# Altium schematic sheet Keymatrix_switches.SchDoc: Keymatrix switches
size 594 x 420 mm; SheetNumber: 2; SheetTotal: 4; DocSize: DINA2
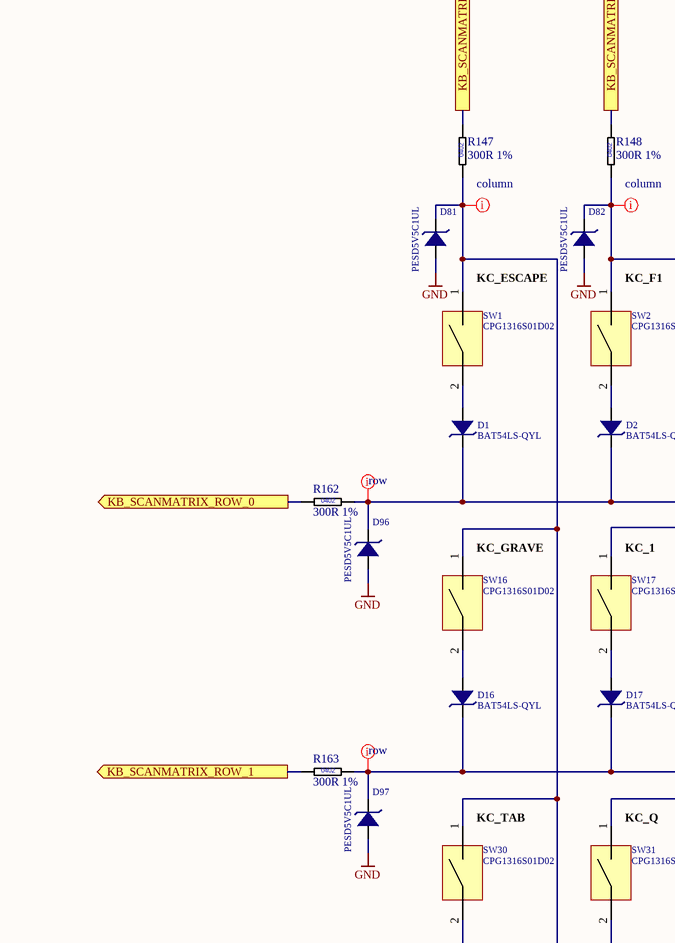
[diagram p0: Keymatrix_switches.SchDoc, top middle]
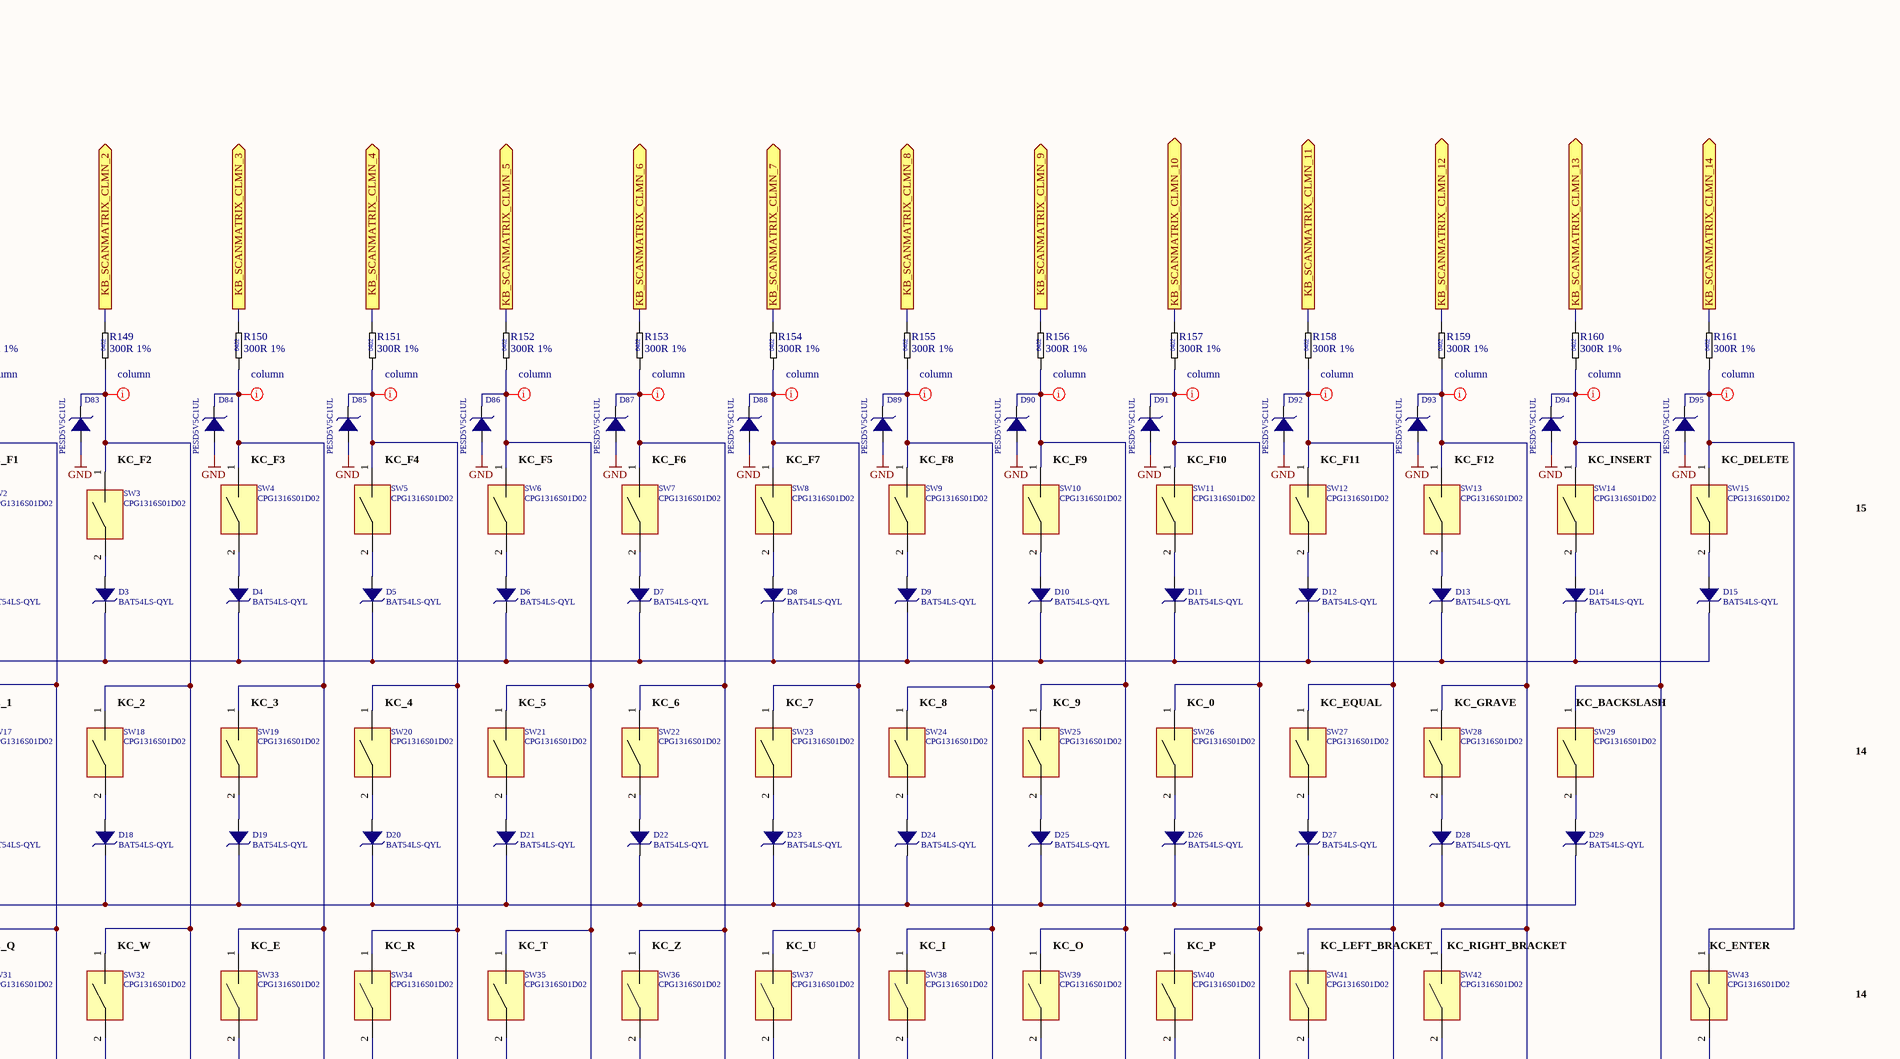
[diagram p1: Keymatrix_switches.SchDoc, top right]
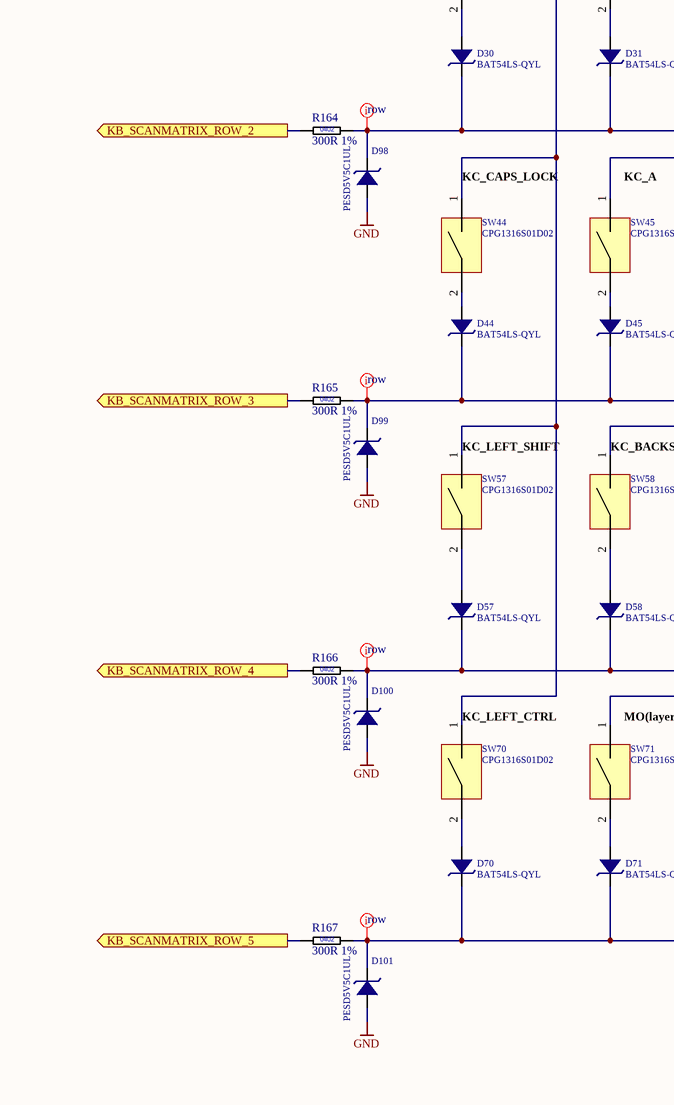
[diagram p2: Keymatrix_switches.SchDoc, bottom middle]
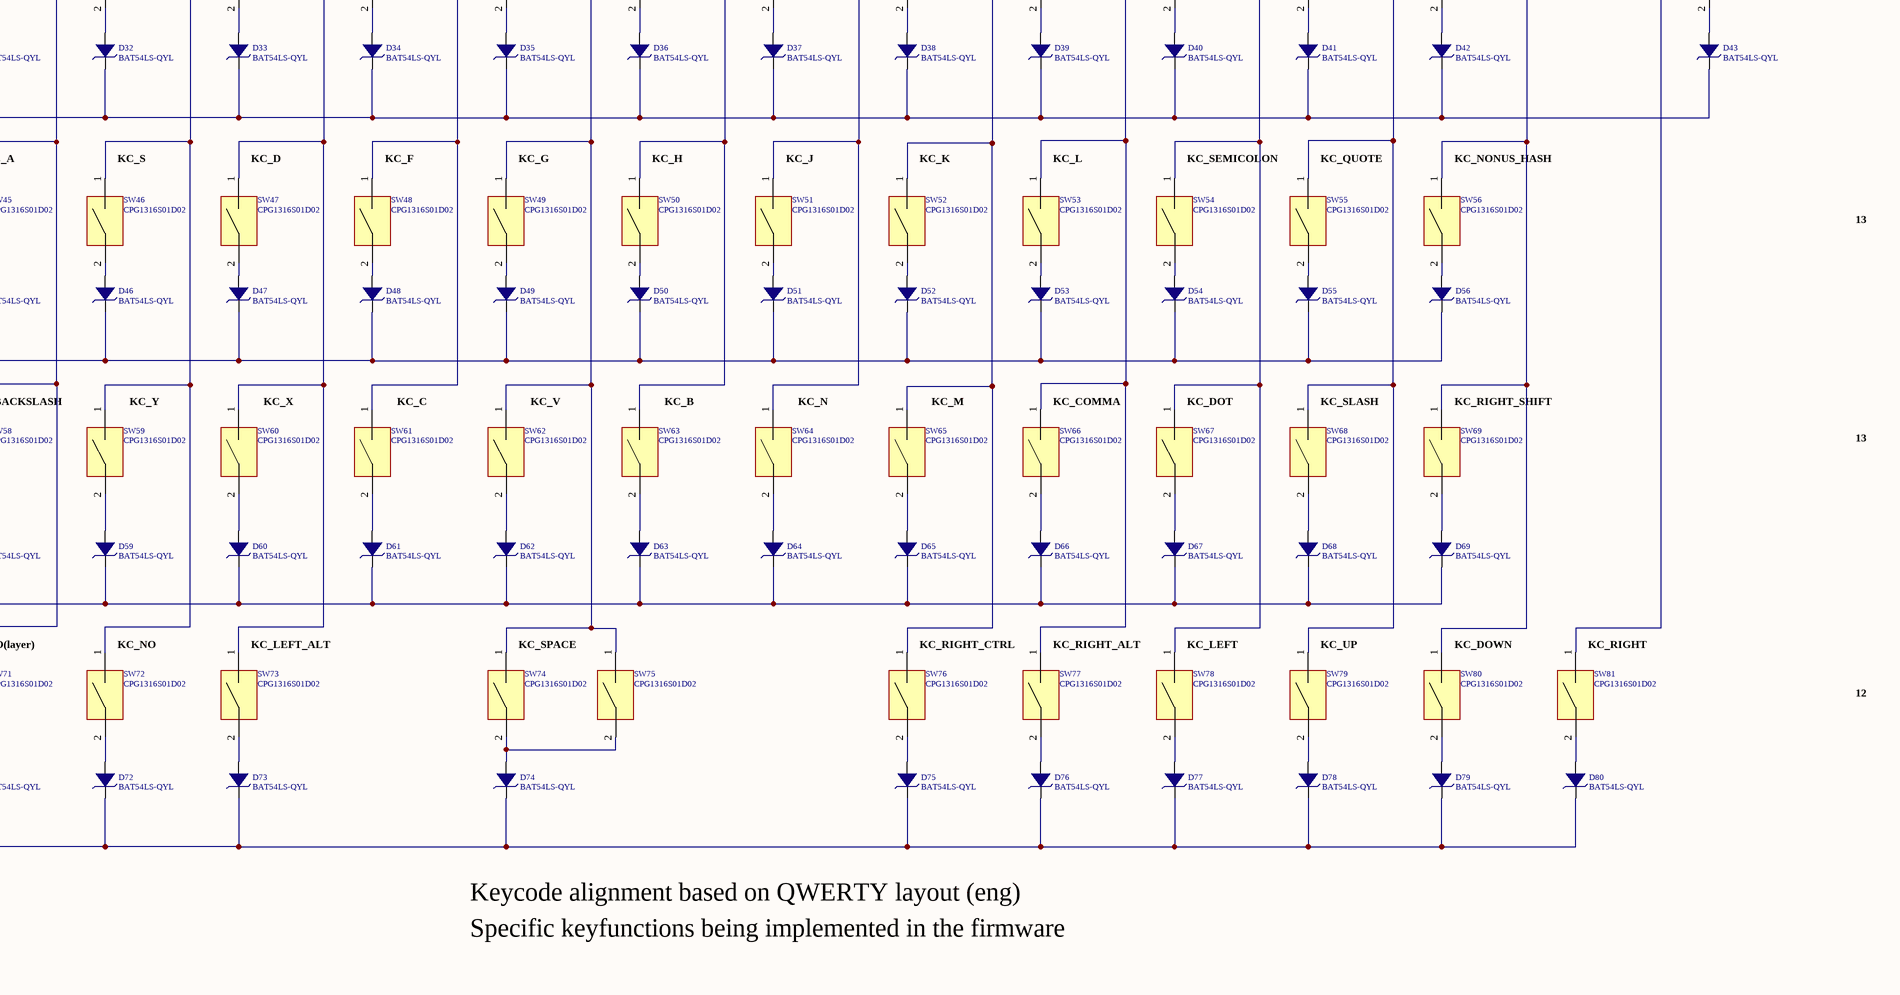
[diagram p3: Keymatrix_switches.SchDoc, bottom right]

## Parts
?  (no value)  (graphical)
D1  BAT54LS-QYL  [DFN1006-2A]
D2  BAT54LS-QYL  [DFN1006-2A]
D3  BAT54LS-QYL  [DFN1006-2A]
D4  BAT54LS-QYL  [DFN1006-2A]
D5  BAT54LS-QYL  [DFN1006-2A]
D6  BAT54LS-QYL  [DFN1006-2A]
D7  BAT54LS-QYL  [DFN1006-2A]
D8  BAT54LS-QYL  [DFN1006-2A]
D9  BAT54LS-QYL  [DFN1006-2A]
D10  BAT54LS-QYL  [DFN1006-2A]
D11  BAT54LS-QYL  [DFN1006-2A]
D12  BAT54LS-QYL  [DFN1006-2A]
D13  BAT54LS-QYL  [DFN1006-2A]
D14  BAT54LS-QYL  [DFN1006-2A]
D15  BAT54LS-QYL  [DFN1006-2A]
D16  BAT54LS-QYL  [DFN1006-2A]
D17  BAT54LS-QYL  [DFN1006-2A]
D18  BAT54LS-QYL  [DFN1006-2A]
D19  BAT54LS-QYL  [DFN1006-2A]
D20  BAT54LS-QYL  [DFN1006-2A]
D21  BAT54LS-QYL  [DFN1006-2A]
D22  BAT54LS-QYL  [DFN1006-2A]
D23  BAT54LS-QYL  [DFN1006-2A]
D24  BAT54LS-QYL  [DFN1006-2A]
D25  BAT54LS-QYL  [DFN1006-2A]
D26  BAT54LS-QYL  [DFN1006-2A]
D27  BAT54LS-QYL  [DFN1006-2A]
D28  BAT54LS-QYL  [DFN1006-2A]
D29  BAT54LS-QYL  [DFN1006-2A]
D30  BAT54LS-QYL  [DFN1006-2A]
D31  BAT54LS-QYL  [DFN1006-2A]
D32  BAT54LS-QYL  [DFN1006-2A]
D33  BAT54LS-QYL  [DFN1006-2A]
D34  BAT54LS-QYL  [DFN1006-2A]
D35  BAT54LS-QYL  [DFN1006-2A]
D36  BAT54LS-QYL  [DFN1006-2A]
D37  BAT54LS-QYL  [DFN1006-2A]
D38  BAT54LS-QYL  [DFN1006-2A]
D39  BAT54LS-QYL  [DFN1006-2A]
D40  BAT54LS-QYL  [DFN1006-2A]
D41  BAT54LS-QYL  [DFN1006-2A]
D42  BAT54LS-QYL  [DFN1006-2A]
D43  BAT54LS-QYL  [DFN1006-2A]
D44  BAT54LS-QYL  [DFN1006-2A]
D45  BAT54LS-QYL  [DFN1006-2A]
D46  BAT54LS-QYL  [DFN1006-2A]
D47  BAT54LS-QYL  [DFN1006-2A]
D48  BAT54LS-QYL  [DFN1006-2A]
D49  BAT54LS-QYL  [DFN1006-2A]
D50  BAT54LS-QYL  [DFN1006-2A]
D51  BAT54LS-QYL  [DFN1006-2A]
D52  BAT54LS-QYL  [DFN1006-2A]
D53  BAT54LS-QYL  [DFN1006-2A]
D54  BAT54LS-QYL  [DFN1006-2A]
D55  BAT54LS-QYL  [DFN1006-2A]
D56  BAT54LS-QYL  [DFN1006-2A]
D57  BAT54LS-QYL  [DFN1006-2A]
D58  BAT54LS-QYL  [DFN1006-2A]
D59  BAT54LS-QYL  [DFN1006-2A]
D60  BAT54LS-QYL  [DFN1006-2A]
D61  BAT54LS-QYL  [DFN1006-2A]
D62  BAT54LS-QYL  [DFN1006-2A]
D63  BAT54LS-QYL  [DFN1006-2A]
D64  BAT54LS-QYL  [DFN1006-2A]
D65  BAT54LS-QYL  [DFN1006-2A]
D66  BAT54LS-QYL  [DFN1006-2A]
D67  BAT54LS-QYL  [DFN1006-2A]
D68  BAT54LS-QYL  [DFN1006-2A]
D69  BAT54LS-QYL  [DFN1006-2A]
D70  BAT54LS-QYL  [DFN1006-2A]
D71  BAT54LS-QYL  [DFN1006-2A]
D72  BAT54LS-QYL  [DFN1006-2A]
D73  BAT54LS-QYL  [DFN1006-2A]
D74  BAT54LS-QYL  [DFN1006-2A]
D75  BAT54LS-QYL  [DFN1006-2A]
D76  BAT54LS-QYL  [DFN1006-2A]
D77  BAT54LS-QYL  [DFN1006-2A]
D78  BAT54LS-QYL  [DFN1006-2A]
D79  BAT54LS-QYL  [DFN1006-2A]
D80  BAT54LS-QYL  [DFN1006-2A]
D81  PESD5V5C1UL  [DFN65P100X50-2N]
D82  PESD5V5C1UL  [DFN65P100X50-2N]
D83  PESD5V5C1UL  [DFN65P100X50-2N]
D84  PESD5V5C1UL  [DFN65P100X50-2N]
D85  PESD5V5C1UL  [DFN65P100X50-2N]
D86  PESD5V5C1UL  [DFN65P100X50-2N]
D87  PESD5V5C1UL  [DFN65P100X50-2N]
D88  PESD5V5C1UL  [DFN65P100X50-2N]
D89  PESD5V5C1UL  [DFN65P100X50-2N]
D90  PESD5V5C1UL  [DFN65P100X50-2N]
D91  PESD5V5C1UL  [DFN65P100X50-2N]
D92  PESD5V5C1UL  [DFN65P100X50-2N]
D93  PESD5V5C1UL  [DFN65P100X50-2N]
D94  PESD5V5C1UL  [DFN65P100X50-2N]
D95  PESD5V5C1UL  [DFN65P100X50-2N]
D96  PESD5V5C1UL  [DFN65P100X50-2N]
D97  PESD5V5C1UL  [DFN65P100X50-2N]
D98  PESD5V5C1UL  [DFN65P100X50-2N]
D99  PESD5V5C1UL  [DFN65P100X50-2N]
D100  PESD5V5C1UL  [DFN65P100X50-2N]
D101  PESD5V5C1UL  [DFN65P100X50-2N]
R147  300R 1%  [RESC1005X04L]
R148  300R 1%  [RESC1005X04L]
R149  300R 1%  [RESC1005X04L]
R150  300R 1%  [RESC1005X04L]
R151  300R 1%  [RESC1005X04L]
R152  300R 1%  [RESC1005X04L]
R153  300R 1%  [RESC1005X04L]
R154  300R 1%  [RESC1005X04L]
R155  300R 1%  [RESC1005X04L]
R156  300R 1%  [RESC1005X04L]
R157  300R 1%  [RESC1005X04L]
R158  300R 1%  [RESC1005X04L]
R159  300R 1%  [RESC1005X04L]
R160  300R 1%  [RESC1005X04L]
R161  300R 1%  [RESC1005X04L]
R162  300R 1%  [RESC1005X04L]
R163  300R 1%  [RESC1005X04L]
R164  300R 1%  [RESC1005X04L]
R165  300R 1%  [RESC1005X04L]
R166  300R 1%  [RESC1005X04L]
R167  300R 1%  [RESC1005X04L]
SW1  CPG1316S01D02  [SW_KEYBOARD_KAIHL-PG1316S]
SW2  CPG1316S01D02  [SW_KEYBOARD_KAIHL-PG1316S]
SW3  CPG1316S01D02  [SW_KEYBOARD_KAIHL-PG1316S]
SW4  CPG1316S01D02  [SW_KEYBOARD_KAIHL-PG1316S]
SW5  CPG1316S01D02  [SW_KEYBOARD_KAIHL-PG1316S]
SW6  CPG1316S01D02  [SW_KEYBOARD_KAIHL-PG1316S]
SW7  CPG1316S01D02  [SW_KEYBOARD_KAIHL-PG1316S]
SW8  CPG1316S01D02  [SW_KEYBOARD_KAIHL-PG1316S]
SW9  CPG1316S01D02  [SW_KEYBOARD_KAIHL-PG1316S]
SW10  CPG1316S01D02  [SW_KEYBOARD_KAIHL-PG1316S]
SW11  CPG1316S01D02  [SW_KEYBOARD_KAIHL-PG1316S]
SW12  CPG1316S01D02  [SW_KEYBOARD_KAIHL-PG1316S]
SW13  CPG1316S01D02  [SW_KEYBOARD_KAIHL-PG1316S]
SW14  CPG1316S01D02  [SW_KEYBOARD_KAIHL-PG1316S]
SW15  CPG1316S01D02  [SW_KEYBOARD_KAIHL-PG1316S]
SW16  CPG1316S01D02  [SW_KEYBOARD_KAIHL-PG1316S]
SW17  CPG1316S01D02  [SW_KEYBOARD_KAIHL-PG1316S]
SW18  CPG1316S01D02  [SW_KEYBOARD_KAIHL-PG1316S]
SW19  CPG1316S01D02  [SW_KEYBOARD_KAIHL-PG1316S]
SW20  CPG1316S01D02  [SW_KEYBOARD_KAIHL-PG1316S]
SW21  CPG1316S01D02  [SW_KEYBOARD_KAIHL-PG1316S]
SW22  CPG1316S01D02  [SW_KEYBOARD_KAIHL-PG1316S]
SW23  CPG1316S01D02  [SW_KEYBOARD_KAIHL-PG1316S]
SW24  CPG1316S01D02  [SW_KEYBOARD_KAIHL-PG1316S]
SW25  CPG1316S01D02  [SW_KEYBOARD_KAIHL-PG1316S]
SW26  CPG1316S01D02  [SW_KEYBOARD_KAIHL-PG1316S]
SW27  CPG1316S01D02  [SW_KEYBOARD_KAIHL-PG1316S]
SW28  CPG1316S01D02  [SW_KEYBOARD_KAIHL-PG1316S]
SW29  CPG1316S01D02  [SW_KEYBOARD_KAIHL-PG1316S]
SW30  CPG1316S01D02  [SW_KEYBOARD_KAIHL-PG1316S]
SW31  CPG1316S01D02  [SW_KEYBOARD_KAIHL-PG1316S]
SW32  CPG1316S01D02  [SW_KEYBOARD_KAIHL-PG1316S]
SW33  CPG1316S01D02  [SW_KEYBOARD_KAIHL-PG1316S]
SW34  CPG1316S01D02  [SW_KEYBOARD_KAIHL-PG1316S]
SW35  CPG1316S01D02  [SW_KEYBOARD_KAIHL-PG1316S]
SW36  CPG1316S01D02  [SW_KEYBOARD_KAIHL-PG1316S]
SW37  CPG1316S01D02  [SW_KEYBOARD_KAIHL-PG1316S]
SW38  CPG1316S01D02  [SW_KEYBOARD_KAIHL-PG1316S]
SW39  CPG1316S01D02  [SW_KEYBOARD_KAIHL-PG1316S]
SW40  CPG1316S01D02  [SW_KEYBOARD_KAIHL-PG1316S]
SW41  CPG1316S01D02  [SW_KEYBOARD_KAIHL-PG1316S]
SW42  CPG1316S01D02  [SW_KEYBOARD_KAIHL-PG1316S]
SW43  CPG1316S01D02  [SW_KEYBOARD_KAIHL-PG1316S]
SW44  CPG1316S01D02  [SW_KEYBOARD_KAIHL-PG1316S]
SW45  CPG1316S01D02  [SW_KEYBOARD_KAIHL-PG1316S]
SW46  CPG1316S01D02  [SW_KEYBOARD_KAIHL-PG1316S]
SW47  CPG1316S01D02  [SW_KEYBOARD_KAIHL-PG1316S]
SW48  CPG1316S01D02  [SW_KEYBOARD_KAIHL-PG1316S]
SW49  CPG1316S01D02  [SW_KEYBOARD_KAIHL-PG1316S]
SW50  CPG1316S01D02  [SW_KEYBOARD_KAIHL-PG1316S]
SW51  CPG1316S01D02  [SW_KEYBOARD_KAIHL-PG1316S]
SW52  CPG1316S01D02  [SW_KEYBOARD_KAIHL-PG1316S]
SW53  CPG1316S01D02  [SW_KEYBOARD_KAIHL-PG1316S]
SW54  CPG1316S01D02  [SW_KEYBOARD_KAIHL-PG1316S]
SW55  CPG1316S01D02  [SW_KEYBOARD_KAIHL-PG1316S]
SW56  CPG1316S01D02  [SW_KEYBOARD_KAIHL-PG1316S]
SW57  CPG1316S01D02  [SW_KEYBOARD_KAIHL-PG1316S]
SW58  CPG1316S01D02  [SW_KEYBOARD_KAIHL-PG1316S]
SW59  CPG1316S01D02  [SW_KEYBOARD_KAIHL-PG1316S]
SW60  CPG1316S01D02  [SW_KEYBOARD_KAIHL-PG1316S]
SW61  CPG1316S01D02  [SW_KEYBOARD_KAIHL-PG1316S]
SW62  CPG1316S01D02  [SW_KEYBOARD_KAIHL-PG1316S]
SW63  CPG1316S01D02  [SW_KEYBOARD_KAIHL-PG1316S]
SW64  CPG1316S01D02  [SW_KEYBOARD_KAIHL-PG1316S]
SW65  CPG1316S01D02  [SW_KEYBOARD_KAIHL-PG1316S]
SW66  CPG1316S01D02  [SW_KEYBOARD_KAIHL-PG1316S]
SW67  CPG1316S01D02  [SW_KEYBOARD_KAIHL-PG1316S]
SW68  CPG1316S01D02  [SW_KEYBOARD_KAIHL-PG1316S]
SW69  CPG1316S01D02  [SW_KEYBOARD_KAIHL-PG1316S]
SW70  CPG1316S01D02  [SW_KEYBOARD_KAIHL-PG1316S]
SW71  CPG1316S01D02  [SW_KEYBOARD_KAIHL-PG1316S]
SW72  CPG1316S01D02  [SW_KEYBOARD_KAIHL-PG1316S]
SW73  CPG1316S01D02  [SW_KEYBOARD_KAIHL-PG1316S]
SW74  CPG1316S01D02  [SW_KEYBOARD_KAIHL-PG1316S]
SW75  CPG1316S01D02  [SW_KEYBOARD_KAIHL-PG1316S]
SW76  CPG1316S01D02  [SW_KEYBOARD_KAIHL-PG1316S]
SW77  CPG1316S01D02  [SW_KEYBOARD_KAIHL-PG1316S]
SW78  CPG1316S01D02  [SW_KEYBOARD_KAIHL-PG1316S]
SW79  CPG1316S01D02  [SW_KEYBOARD_KAIHL-PG1316S]
SW80  CPG1316S01D02  [SW_KEYBOARD_KAIHL-PG1316S]
SW81  CPG1316S01D02  [SW_KEYBOARD_KAIHL-PG1316S]

## Ports
KB_SCANMATRIX_CLMN_0 (out), KB_SCANMATRIX_CLMN_1 (out), KB_SCANMATRIX_CLMN_2 (out), KB_SCANMATRIX_CLMN_3 (out), KB_SCANMATRIX_CLMN_4 (out), KB_SCANMATRIX_CLMN_5 (out), KB_SCANMATRIX_CLMN_6 (out), KB_SCANMATRIX_CLMN_7 (out), KB_SCANMATRIX_CLMN_8 (out), KB_SCANMATRIX_CLMN_9 (out), KB_SCANMATRIX_CLMN_10 (out), KB_SCANMATRIX_CLMN_11 (out), KB_SCANMATRIX_CLMN_12 (out), KB_SCANMATRIX_CLMN_13 (out), KB_SCANMATRIX_CLMN_14 (out), KB_SCANMATRIX_ROW_0 (out), KB_SCANMATRIX_ROW_1 (out), KB_SCANMATRIX_ROW_2 (out), KB_SCANMATRIX_ROW_3 (out), KB_SCANMATRIX_ROW_4 (out), KB_SCANMATRIX_ROW_5 (out)

## Nets
GND: D81.2 D82.2 D83.2 D84.2 D85.2 D86.2 D87.2 D88.2 D89.2 D90.2 D91.2 D92.2 D93.2 D94.2 D95.2 D96.2 D97.2 D98.2 D99.2 D100.2 D101.2
KB_SCANMATRIX_CLMN_0: R147.2 ; port KB_SCANMATRIX_CLMN_0
KB_SCANMATRIX_CLMN_1: R148.2 ; port KB_SCANMATRIX_CLMN_1
KB_SCANMATRIX_CLMN_2: R149.2 ; port KB_SCANMATRIX_CLMN_2
KB_SCANMATRIX_CLMN_3: R150.2 ; port KB_SCANMATRIX_CLMN_3
KB_SCANMATRIX_CLMN_4: R151.2 ; port KB_SCANMATRIX_CLMN_4
KB_SCANMATRIX_CLMN_5: R152.2 ; port KB_SCANMATRIX_CLMN_5
KB_SCANMATRIX_CLMN_6: R153.2 ; port KB_SCANMATRIX_CLMN_6
KB_SCANMATRIX_CLMN_7: R154.2 ; port KB_SCANMATRIX_CLMN_7
KB_SCANMATRIX_CLMN_8: R155.2 ; port KB_SCANMATRIX_CLMN_8
KB_SCANMATRIX_CLMN_9: R156.2 ; port KB_SCANMATRIX_CLMN_9
KB_SCANMATRIX_CLMN_10: R157.2 ; port KB_SCANMATRIX_CLMN_10
KB_SCANMATRIX_CLMN_11: R158.2 ; port KB_SCANMATRIX_CLMN_11
KB_SCANMATRIX_CLMN_12: R159.2 ; port KB_SCANMATRIX_CLMN_12
KB_SCANMATRIX_CLMN_13: R160.2 ; port KB_SCANMATRIX_CLMN_13
KB_SCANMATRIX_CLMN_14: R161.2 ; port KB_SCANMATRIX_CLMN_14
KB_SCANMATRIX_ROW_0: R162.1 ; port KB_SCANMATRIX_ROW_0
KB_SCANMATRIX_ROW_1: R163.1 ; port KB_SCANMATRIX_ROW_1
KB_SCANMATRIX_ROW_2: R164.1 ; port KB_SCANMATRIX_ROW_2
KB_SCANMATRIX_ROW_3: R165.1 ; port KB_SCANMATRIX_ROW_3
KB_SCANMATRIX_ROW_4: R166.1 ; port KB_SCANMATRIX_ROW_4
KB_SCANMATRIX_ROW_5: R167.1 ; port KB_SCANMATRIX_ROW_5
NetD1_1: D1.1 D2.1 D3.1 D4.1 D5.1 D6.1 D7.1 D8.1 D9.1 D10.1 D11.1 D12.1 D13.1 D14.1 D15.1 D96.1 R162.2
NetD1_2: D1.2 SW1.2
NetD2_2: D2.2 SW2.2
NetD3_2: D3.2 SW3.2
NetD4_2: D4.2 SW4.2
NetD5_2: D5.2 SW5.2
NetD6_2: D6.2 SW6.2
NetD7_2: D7.2 SW7.2
NetD8_2: D8.2 SW8.2
NetD9_2: D9.2 SW9.2
NetD10_2: D10.2 SW10.2
NetD11_2: D11.2 SW11.2
NetD12_2: D12.2 SW12.2
NetD13_2: D13.2 SW13.2
NetD14_2: D14.2 SW14.2
NetD15_2: D15.2 SW15.2
NetD16_1: D16.1 D17.1 D18.1 D19.1 D20.1 D21.1 D22.1 D23.1 D24.1 D25.1 D26.1 D27.1 D28.1 D29.1 D97.1 R163.2
NetD16_2: D16.2 SW16.2
NetD17_2: D17.2 SW17.2
NetD18_2: D18.2 SW18.2
NetD19_2: D19.2 SW19.2
NetD20_2: D20.2 SW20.2
NetD21_2: D21.2 SW21.2
NetD22_2: D22.2 SW22.2
NetD23_2: D23.2 SW23.2
NetD24_2: D24.2 SW24.2
NetD25_2: D25.2 SW25.2
NetD26_2: D26.2 SW26.2
NetD27_2: D27.2 SW27.2
NetD28_2: D28.2 SW28.2
NetD29_2: D29.2 SW29.2
NetD30_1: D30.1 D31.1 D32.1 D33.1 D34.1 D35.1 D36.1 D37.1 D38.1 D39.1 D40.1 D41.1 D42.1 D43.1 D98.1 R164.2
NetD30_2: D30.2 SW30.2
NetD31_2: D31.2 SW31.2
NetD32_2: D32.2 SW32.2
NetD33_2: D33.2 SW33.2
NetD34_2: D34.2 SW34.2
NetD35_2: D35.2 SW35.2
NetD36_2: D36.2 SW36.2
NetD37_2: D37.2 SW37.2
NetD38_2: D38.2 SW38.2
NetD39_2: D39.2 SW39.2
NetD40_2: D40.2 SW40.2
NetD41_2: D41.2 SW41.2
NetD42_2: D42.2 SW42.2
NetD43_2: D43.2 SW43.2
NetD44_1: D44.1 D45.1 D46.1 D47.1 D48.1 D49.1 D50.1 D51.1 D52.1 D53.1 D54.1 D55.1 D56.1 D99.1 R165.2
NetD44_2: D44.2 SW44.2
NetD45_2: D45.2 SW45.2
NetD46_2: D46.2 SW46.2
NetD47_2: D47.2 SW47.2
NetD48_2: D48.2 SW48.2
NetD49_2: D49.2 SW49.2
NetD50_2: D50.2 SW50.2
NetD51_2: D51.2 SW51.2
NetD52_2: D52.2 SW52.2
NetD53_2: D53.2 SW53.2
NetD54_2: D54.2 SW54.2
NetD55_2: D55.2 SW55.2
NetD56_2: D56.2 SW56.2
NetD57_1: D57.1 D58.1 D59.1 D60.1 D61.1 D62.1 D63.1 D64.1 D65.1 D66.1 D67.1 D68.1 D69.1 D100.1 R166.2
NetD57_2: D57.2 SW57.2
NetD58_2: D58.2 SW58.2
NetD59_2: D59.2 SW59.2
NetD60_2: D60.2 SW60.2
NetD61_2: D61.2 SW61.2
NetD62_2: D62.2 SW62.2
NetD63_2: D63.2 SW63.2
NetD64_2: D64.2 SW64.2
NetD65_2: D65.2 SW65.2
NetD66_2: D66.2 SW66.2
NetD67_2: D67.2 SW67.2
NetD68_2: D68.2 SW68.2
NetD69_2: D69.2 SW69.2
NetD70_1: D70.1 D71.1 D72.1 D73.1 D74.1 D75.1 D76.1 D77.1 D78.1 D79.1 D80.1 D101.1 R167.2
NetD70_2: D70.2 SW70.2
NetD71_2: D71.2 SW71.2
NetD72_2: D72.2 SW72.2
NetD73_2: D73.2 SW73.2
NetD74_2: D74.2 SW74.2 SW75.2
NetD75_2: D75.2 SW76.2
NetD76_2: D76.2 SW77.2
NetD77_2: D77.2 SW78.2
NetD78_2: D78.2 SW79.2
NetD79_2: D79.2 SW80.2
NetD80_2: D80.2 SW81.2
NetD81_1: D81.1 R147.1 SW1.1 SW16.1 SW30.1 SW44.1 SW57.1 SW70.1
NetD82_1: D82.1 R148.1 SW2.1 SW17.1 SW31.1 SW45.1 SW58.1 SW71.1
NetD83_1: D83.1 R149.1 SW3.1 SW18.1 SW32.1 SW46.1 SW59.1 SW72.1
NetD84_1: D84.1 R150.1 SW4.1 SW19.1 SW33.1 SW47.1 SW60.1 SW73.1
NetD85_1: D85.1 R151.1 SW5.1 SW20.1 SW34.1 SW48.1 SW61.1
NetD86_1: D86.1 R152.1 SW6.1 SW21.1 SW35.1 SW49.1 SW62.1 SW74.1 SW75.1
NetD87_1: D87.1 R153.1 SW7.1 SW22.1 SW36.1 SW50.1 SW63.1
NetD88_1: D88.1 R154.1 SW8.1 SW23.1 SW37.1 SW51.1 SW64.1
NetD89_1: D89.1 R155.1 SW9.1 SW24.1 SW38.1 SW52.1 SW65.1 SW76.1
NetD90_1: D90.1 R156.1 SW10.1 SW25.1 SW39.1 SW53.1 SW66.1 SW77.1
NetD91_1: D91.1 R157.1 SW11.1 SW26.1 SW40.1 SW54.1 SW67.1 SW78.1
NetD92_1: D92.1 R158.1 SW12.1 SW27.1 SW41.1 SW55.1 SW68.1 SW79.1
NetD93_1: D93.1 R159.1 SW13.1 SW28.1 SW42.1 SW56.1 SW69.1 SW80.1
NetD94_1: D94.1 R160.1 SW14.1 SW29.1 SW81.1
NetD95_1: D95.1 R161.1 SW15.1 SW43.1

## Layout directives
net class column: NetD81_1, NetD82_1, NetD83_1, NetD84_1, NetD85_1, NetD86_1, NetD87_1, NetD88_1, NetD89_1, NetD90_1, NetD91_1, NetD92_1, NetD93_1, NetD94_1, NetD95_1
net class row: NetD1_1, NetD16_1, NetD30_1, NetD44_1, NetD57_1, NetD70_1

## Notes on the sheet
- KC_ESCAPE
- KC_F1
- KC_F2
- KC_F3
- KC_F4
- KC_F5
- KC_F6
- KC_F7
- KC_F8
- KC_F9
- KC_F10
- KC_F11
- KC_F12
- KC_INSERT
- KC_DELETE
- 15
- (near SW16) KC_GRAVE
- (near SW17) KC_1
- (near SW18) KC_2
- (near SW19) KC_3
- (near SW20) KC_4
- (near SW21) KC_5
- (near SW22) KC_6
- (near SW23) KC_7
- (near SW24) KC_8
- (near SW25) KC_9
- (near SW26) KC_0
- (near SW27) KC_EQUAL
- (near SW28) KC_GRAVE
- (near SW29) KC_BACKSLASH
- 14
- (near SW30) KC_TAB
- (near SW31) KC_Q
- (near SW32) KC_W
- (near SW33) KC_E
- (near SW34) KC_R
- (near SW35) KC_T
- (near SW36) KC_Z
- (near SW37) KC_U
- (near SW38) KC_I
- (near SW39) KC_O
- (near SW40) KC_P
- (near SW41) KC_LEFT_BRACKET
- (near SW42) KC_RIGHT_BRACKET
- (near SW43) KC_ENTER
- (near SW44) KC_CAPS_LOCK
- (near SW45) KC_A
- (near SW46) KC_S
- (near SW47) KC_D
- (near SW48) KC_F
- (near SW49) KC_G
- (near SW50) KC_H
- (near SW51) KC_J
- (near SW52) KC_K
- (near SW53) KC_L
- (near SW54) KC_SEMICOLON
- (near SW55) KC_QUOTE
- (near SW56) KC_NONUS_HASH
- 13
- (near SW57) KC_LEFT_SHIFT
- (near SW58) KC_BACKSLASH
- (near SW59) KC_Y
- (near SW60) KC_X
- (near SW61) KC_C
- (near SW62) KC_V
- (near SW63) KC_B
- (near SW64) KC_N
- (near SW65) KC_M
- (near SW66) KC_COMMA
- (near SW67) KC_DOT
- (near SW68) KC_SLASH
- (near SW69) KC_RIGHT_SHIFT
- (near SW70) KC_LEFT_CTRL
- (near SW71) MO(layer)
- (near SW72) KC_NO
- (near SW73) KC_LEFT_ALT
- (near SW74) KC_SPACE
- (near SW76) KC_RIGHT_CTRL
- (near SW77) KC_RIGHT_ALT
- (near SW78) KC_LEFT
- (near SW79) KC_UP
- (near SW80) KC_DOWN
- (near SW81) KC_RIGHT
- 12
- Keycode alignment based on QWERTY layout (eng)
- Specific keyfunctions being implemented in the firmware
- © OV Tech GmbH - Open Visions Technology
- (in symbol RES_0402_300R_1%) 0402

## Library data of the parts
? = Titleblock_01
D1-D80 = Schottky 30V_BAT54LS-QYL: Schottky Diodes & Rectifiers; Manufacturer 1: Nexperia; Manufacturer 1 Prt. Nr.: BAT54LS-QYL
D81-D101 = ESD 5.5V_PESD5V5C1UL: ESD Diode 5.5V working voltage DFN1006-2; Manufacturer 1: Nexperia; Manufacturer 1 Prt. Nr.: PESD5V5C1UL
R147-R167 = RES_0402_300R_1%: Thick Film Resistors - SMD 300Ω 1%; Manufacturer 1: Panasonic; Manufacturer 1 Prt. Nr.: ERJ-2RKF3000X; Manufacturer 2 Prt. Nr.: SFR01MZPJ301; Manufacturer 2: ROHM Semiconductor
SW1-SW81 = SW_KEYBOARD_CPG1316S01D02: Switch for keyboard, PG1316S series, Push-on type S. P. S. T; Manufacturer 1: Kaihua Electronics; Manufacturer 1 Prt. Nr.: CPG1316S01D02